# EAGLE design Power Distribution (EAGLE 6.2)
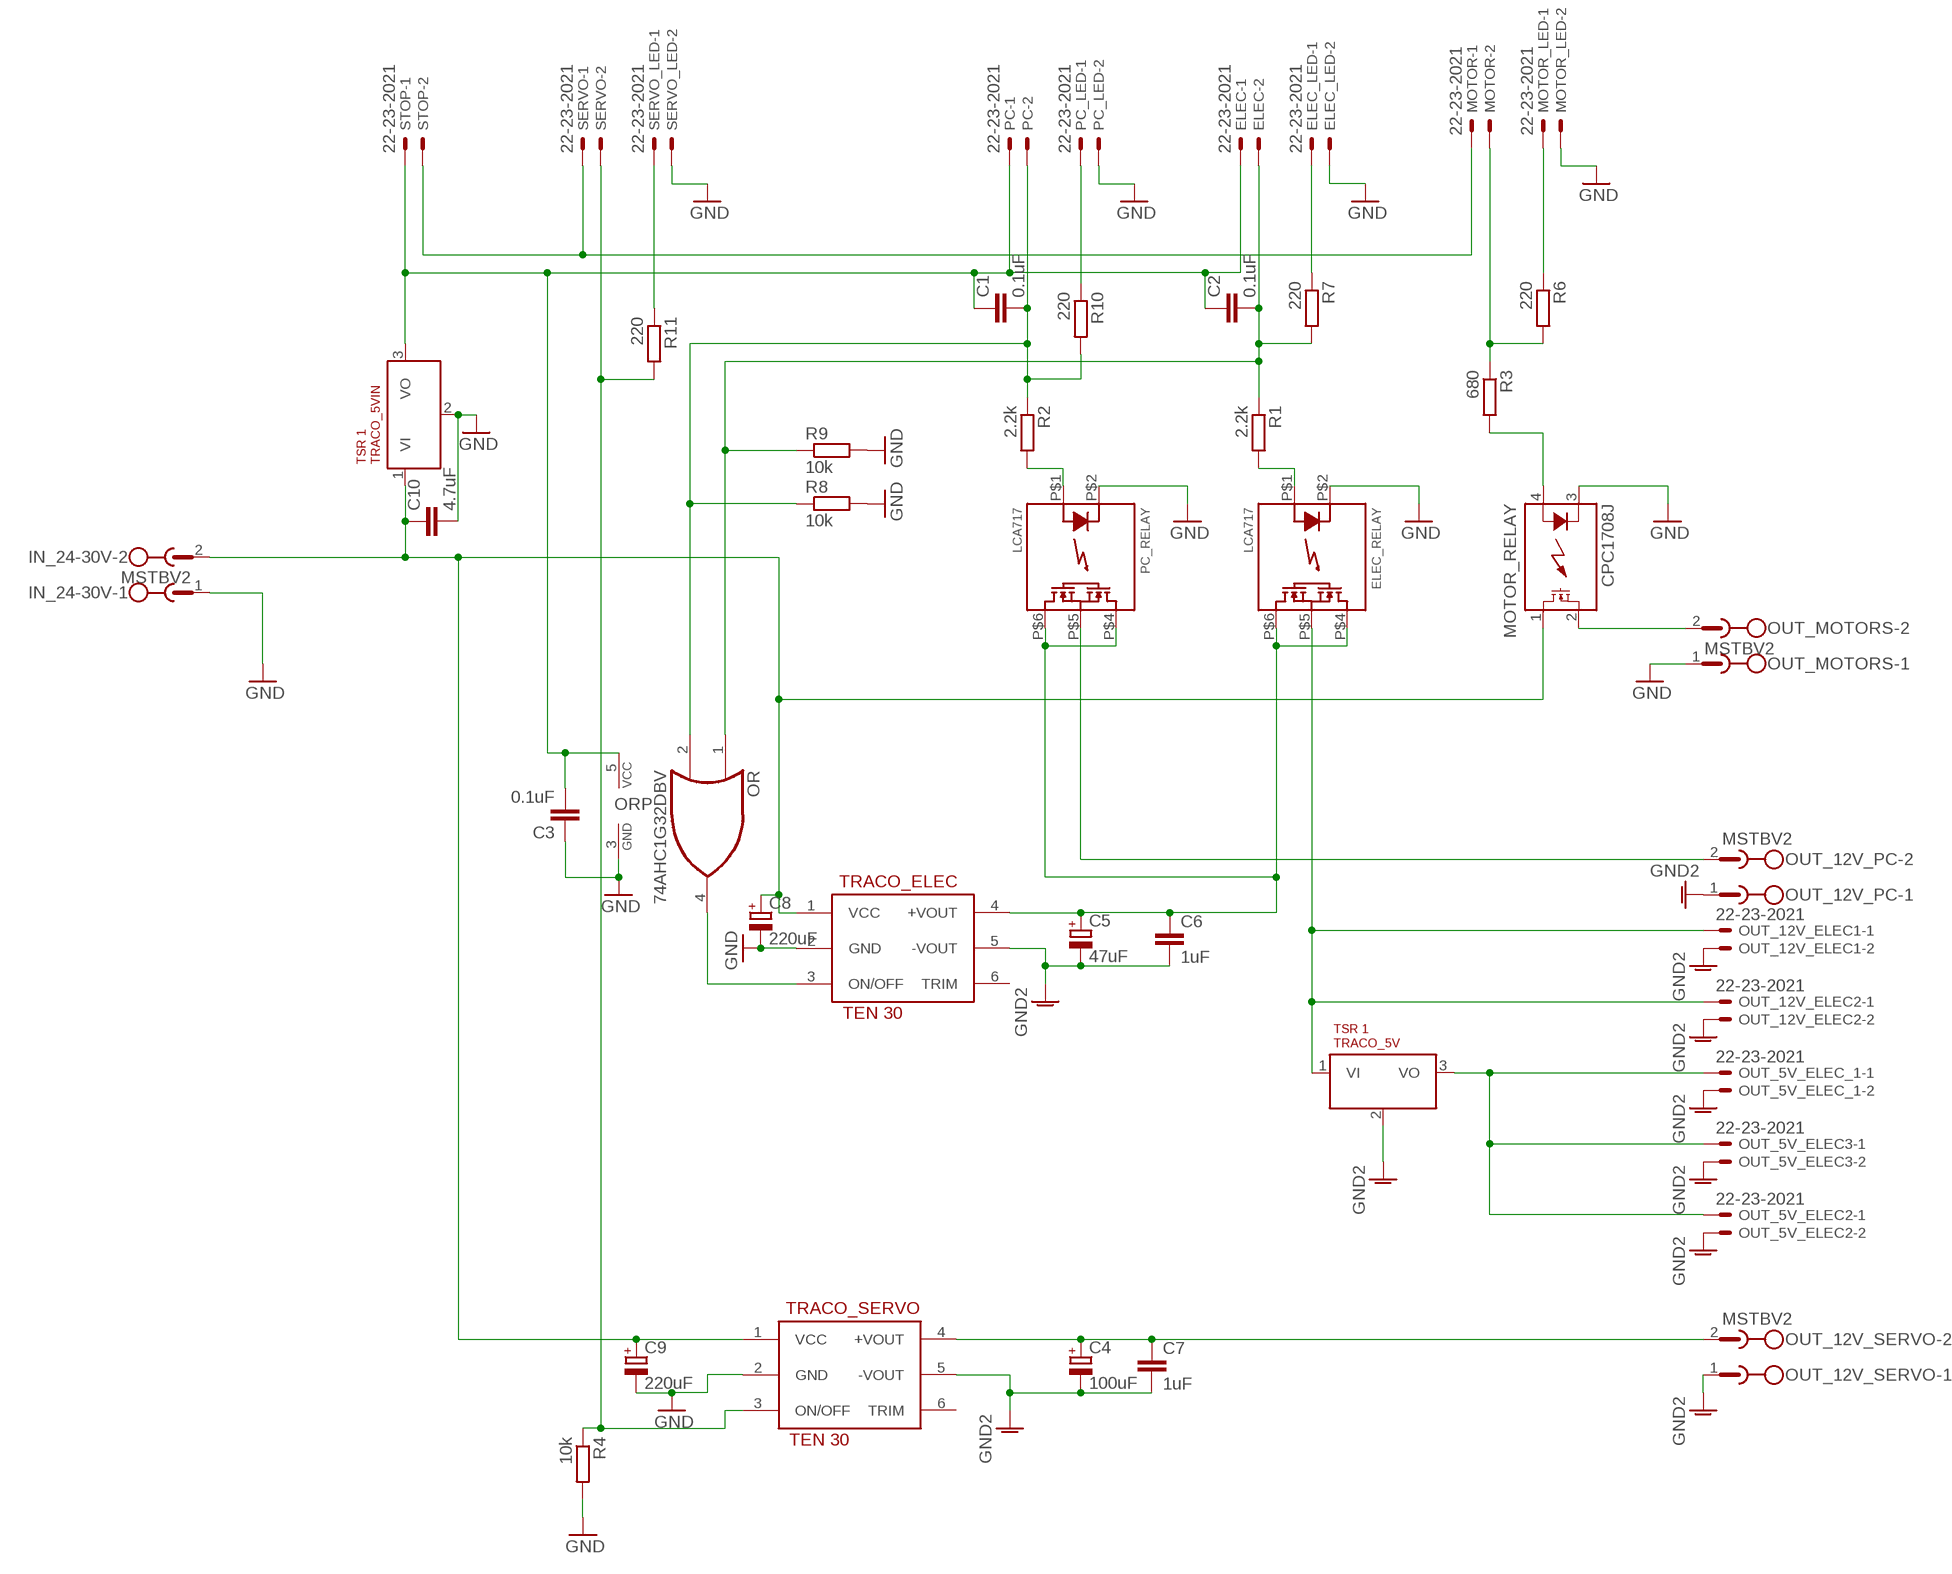
[diagram p0: schematic, sheet 1]

## Parts
C1  0.1uF  C-EUC0805  [C0805]
C2  0.1uF  C-EUC0805  [C0805]
C3  0.1uF  C-EUC0805  [C0805]
C4  100uF  CPOL-EUE2-5  [E2-5]
C5  47uF  CPOL-EUE2-5  [E2-5]
C6  1uF  C-EUC1206  [C1206]
C7  1uF  C-EUC1206  [C1206]
C8  220uF  CPOL-EUE3.5-8  [E3,5-8]
C9  220uF  CPOL-EUE3.5-8  [E3,5-8]
C10  4.7uF  C-EUC1210  [C1210]
ELEC  22-23-2021  [22-23-2021]
ELEC_LED  22-23-2021  [22-23-2021]
ELEC_RELAY  LCA717  [DIP-6]
IN_24-30V  MSTBV2  [MSTBV2]
MOTOR  22-23-2021  [22-23-2021]
MOTOR_LED  22-23-2021  [22-23-2021]
MOTOR_RELAY  CPC1708J  [I4-PAC]
OR  74AHC1G32DBV  [SOT23-5]
OUT_5V_ELEC2  22-23-2021  [22-23-2021]
OUT_5V_ELEC3  22-23-2021  [22-23-2021]
OUT_5V_ELEC_1  22-23-2021  [22-23-2021]
OUT_12V_ELEC1  22-23-2021  [22-23-2021]
OUT_12V_ELEC2  22-23-2021  [22-23-2021]
OUT_12V_PC  MSTBV2  [MSTBV2]
OUT_12V_SERVO  MSTBV2  [MSTBV2]
OUT_MOTORS  MSTBV2  [MSTBV2]
PC  22-23-2021  [22-23-2021]
PC_LED  22-23-2021  [22-23-2021]
PC_RELAY  LCA717  [DIP-6]
R1  2.2k  R-EU_R0805  [R0805]
R2  2.2k  R-EU_R0805  [R0805]
R3  680  R-EU_R0805  [R0805]
R4  10k  R-EU_R0805  [R0805]
R6  220  R-EU_R0805  [R0805]
R7  220  R-EU_R0805  [R0805]
R8  10k  R-EU_R0805  [R0805]
R9  10k  R-EU_R0805  [R0805]
R10  220  R-EU_R0805  [R0805]
R11  220  R-EU_R0805  [R0805]
SERVO  22-23-2021  [22-23-2021]
SERVO_LED  22-23-2021  [22-23-2021]
STOP  22-23-2021  [22-23-2021]
TRACO_5V  TSR-1  [TRACO-TO220]
TRACO_5VIN  TSR-1  [TRACO-TO220]
TRACO_ELEC  TEN-30  [TRACO2X1]
TRACO_SERVO  TEN-50  TEN-30  [TRACO2X1]

## Nets
5V: C1.1 C2.1 C3.2 ELEC.1 OR.5(VCC) PC.1 STOP.1 TRACO_5VIN.3(VO)
AGND: C4.- C5.- C6.2 C7.2 OUT_5V_ELEC2.2 OUT_5V_ELEC3.2 OUT_5V_ELEC_1.2 OUT_12V_ELEC1.2 OUT_12V_ELEC2.2 OUT_12V_PC.1 OUT_12V_SERVO.1 TRACO_5V.2(GND) TRACO_ELEC.5(-VOUT) TRACO_SERVO.5(-VOUT) ; supply symbol labelled GND2
GND: C3.1 C8.- C9.- C10.2 ELEC_LED.2 ELEC_RELAY.P$2 IN_24-30V.1 MOTOR_LED.2 MOTOR_RELAY.3(K) OR.3(GND) OUT_MOTORS.1 PC_LED.2 PC_RELAY.P$2 R4.2 R8.2 R9.2 SERVO_LED.2 TRACO_5VIN.2(GND) TRACO_ELEC.2(GND) TRACO_SERVO.2(GND)
N$1: C8.+ C9.+ C10.1 IN_24-30V.2 MOTOR_RELAY.1(DS1) TRACO_5VIN.1(VI) TRACO_ELEC.1(VCC) TRACO_SERVO.1(VCC)
N$2: C4.+ C7.1 OUT_12V_SERVO.2 TRACO_SERVO.4(+VOUT)
N$3: MOTOR_RELAY.2(DS2) OUT_MOTORS.2
N$5: MOTOR_LED.1 R6.1
N$6: ELEC_RELAY.P$5 OUT_12V_ELEC1.1 OUT_12V_ELEC2.1 TRACO_5V.1(VI)
N$7: OUT_5V_ELEC2.1 OUT_5V_ELEC3.1 OUT_5V_ELEC_1.1 TRACO_5V.3(VO)
N$8: OUT_12V_PC.2 PC_RELAY.P$5
N$9: C5.+ C6.1 ELEC_RELAY.P$4 ELEC_RELAY.P$6 PC_RELAY.P$4 PC_RELAY.P$6 TRACO_ELEC.4(+VOUT)
N$12: MOTOR_RELAY.4(A) R3.2
N$14: ELEC_RELAY.P$1 R1.2
N$15: R4.1 R11.2 SERVO.2 TRACO_SERVO.3(ON/OFF)
N$16: C1.2 OR.2(I1) PC.2 R2.1 R8.1 R10.2
N$17: C2.2 ELEC.2 OR.1(I0) R1.1 R7.2 R9.1
N$18: MOTOR.2 R3.1 R6.2
N$19: MOTOR.1 SERVO.1 STOP.2
N$20: PC_RELAY.P$1 R2.2
N$21: OR.4(O) TRACO_ELEC.3(ON/OFF)
N$22: PC_LED.1 R10.1
N$23: R11.1 SERVO_LED.1
N$24: ELEC_LED.1 R7.1
Unconnected: TRACO_ELEC.6(TRIM) TRACO_SERVO.6(TRIM)

## Library data of the parts
C1-C3 C6 C7 C10 = rcl:C-EU: CAPACITOR, European symbol
C4 C5 C8 C9 = rcl:CPOL-EU: POLARIZED CAPACITOR, European symbol
ELEC ELEC_LED MOTOR MOTOR_LED OUT_5V_ELEC2 OUT_5V_ELEC3 OUT_5V_ELEC_1 OUT_12V_ELEC1 OUT_12V_ELEC2 PC PC_LED SERVO SERVO_LED STOP = con-molex:22-23-2021: .100" (2.54mm) Center Header - 2 Pin; MF: MOLEX; MPN: 22-23-2021; OC_FARNELL: 1462926; OC_NEWARK: 25C3832
ELEC_RELAY PC_RELAY = custom:LCA717
IN_24-30V OUT_12V_PC OUT_12V_SERVO OUT_MOTORS = con-phoenix-508:MSTBV2: PHOENIX; MPN: MSTBV 2,5/2-GF-5.08; OC_FARNELL: 1792792; OC_NEWARK: 69R9845
MOTOR_RELAY = relay:CPC1708J: Single-Pole, Normally Open i4-PAC (TM) DC Power Relay Source: Data sheet <http://www.clare.com/home/pdfs.nsf/www/CPC1708.pdf/$file/CPC1708.pdf>
OR = 74xx-little-us:74*1G32: 2-input OR gate
R1-R4 R6-R11 = rcl:R-EU_: RESISTOR, European symbol
TRACO_5V TRACO_5VIN = custom:TSR-1
TRACO_ELEC TRACO_SERVO = custom:TEN-30

## Board
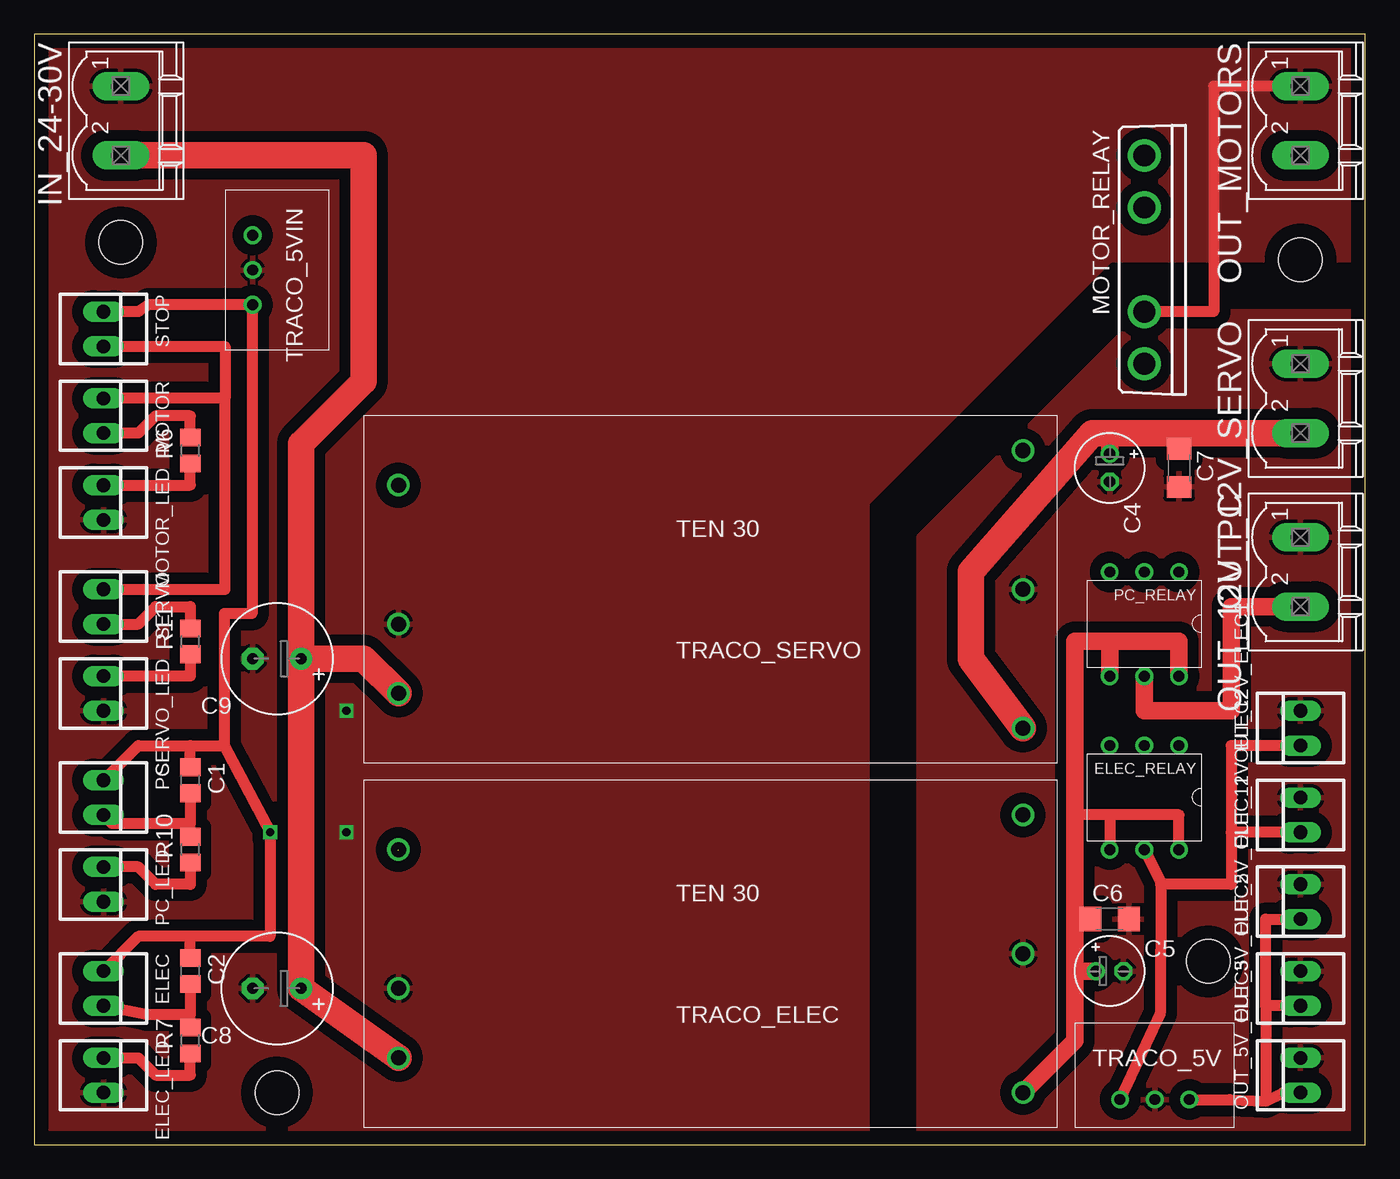
[diagram p1: board, top side]
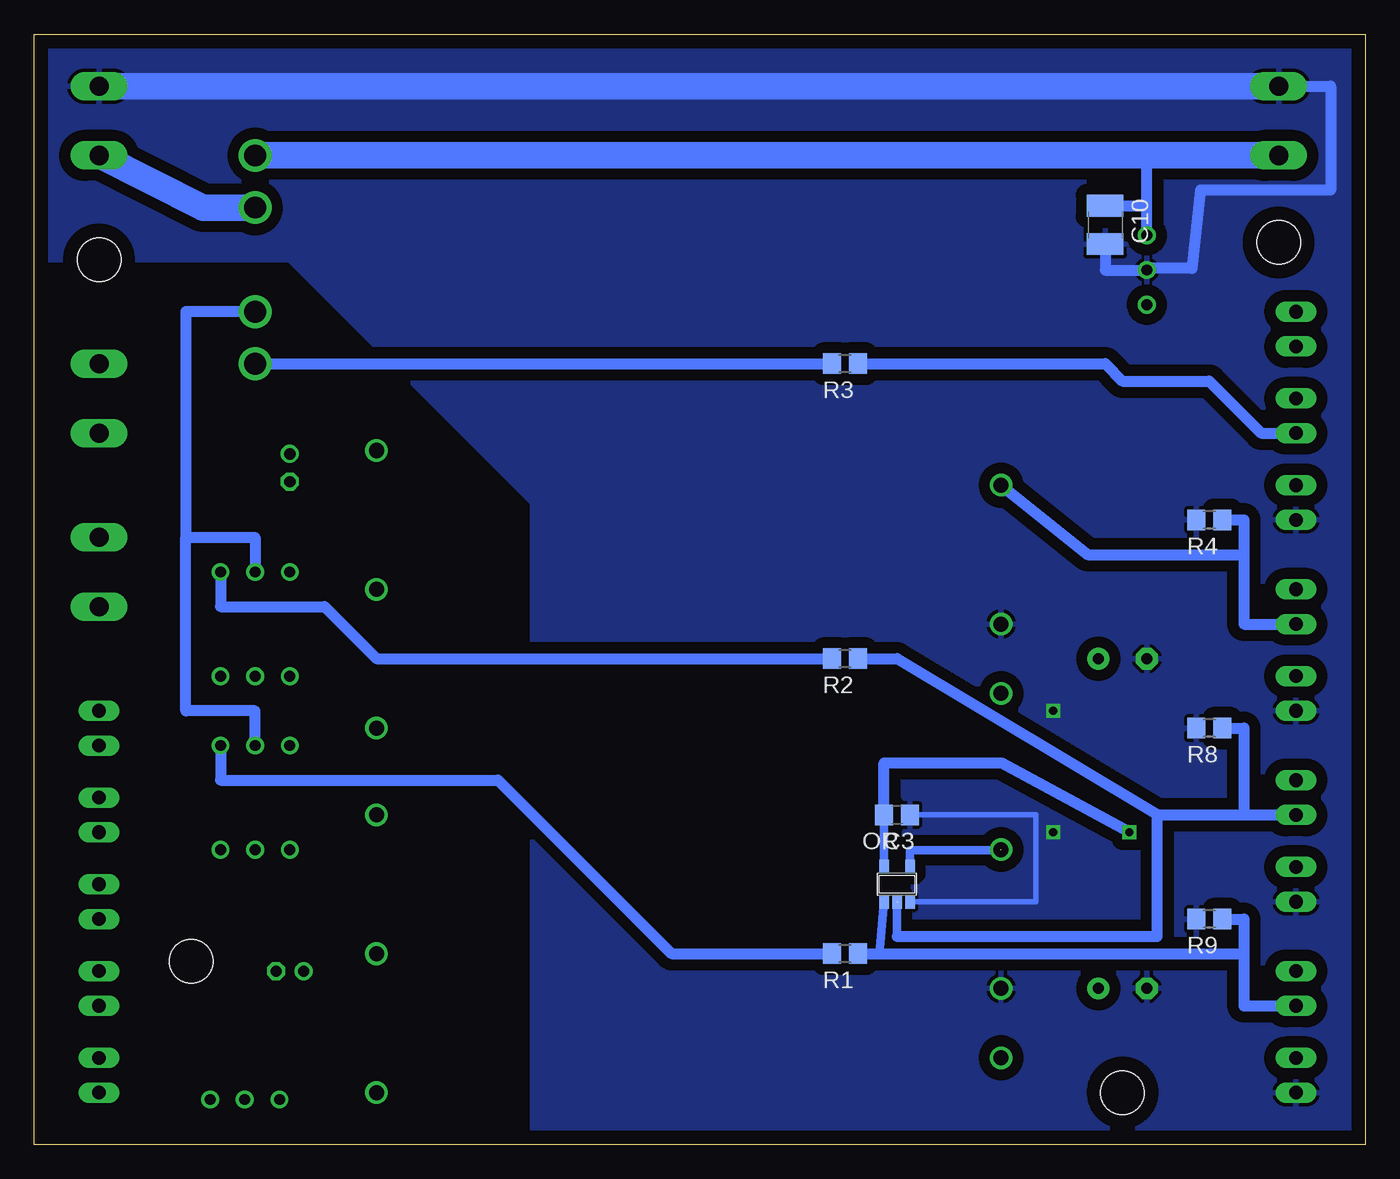
[diagram p2: board, bottom side, seen from below]

Size 97.46 x 81.27 mm. Coordinates in mm from the lower left corner, seen from the top.
Outline: 0,0 97.46,0 97.46,81.27 0,81.27 0,0
Copper layers (1*16): Top 0.035mm / dielectric 1.5mm / Bottom 0.035mm
Design rules: minimum track width 10mil, minimum drill 0.6mm, track to track 8mil, track to pad 8mil, pad to pad 8mil, via to via 8mil, smd to smd 8mil, copper to edge 40mil, drill to drill 8mil, minimum pad ring 10mil, minimum via ring 8mil, stop-mask expansion 4mil, vias tented up to drill 0mil, thermal gap 10mil
Holes 3.2 mm at 92.71,64.77 17.78,3.81 6.35,66.04 85.95,13.41

### Footprints (pad centres in the part's own frame; a part is rotated, then mirrored left to right if it is on the bottom)
C0805 = smd 1.3 x 1.5: 1 -0.95,0; 2 0.95,0
E2-5 = drill 0.813 pad 1.27: + -1.016,0 | drill 0.813 pad 1.27 octagon: - 1.016,0
C1206 = smd 1.6 x 1.8: 1 -1.4,0; 2 1.4,0
E3,5-8 = drill 0.813 pad 1.6: + -1.778,0 | drill 0.813 pad 1.6 octagon: - 1.778,0
C1210 = smd 1.6 x 2.7: 1 -1.4,0; 2 1.4,0
22-23-2021 = drill 1 long: 1 -1.27,0; 2 1.27,0
DIP-6 = drill 0.8: P$1 -2.54,-3.81; P$2 0,-3.81; P$3 2.54,-3.81; P$4 2.54,3.81; P$5 0,3.81; P$6 -2.54,3.81
MSTBV2 = drill 1.397 long: 1 -2.54,0; 2 2.54,0
I4-PAC = drill 1.6 pad 2.3: 1 -7.62,0; 2 -3.81,0; 3 3.81,0; 4 7.62,0
SOT23-5 = smd 0.69 x 0.99: 1 -0.95,-1.29; 2 0,-1.29; 3 0.95,-1.29; 4 0.95,1.3; 5 -0.95,1.3
R0805 = smd 1.3 x 1.5: 1 -0.95,0; 2 0.95,0
TRACO-TO220 = drill 0.8: 1 3.302,-5.588; 2 5.842,-5.588; 3 8.382,-5.588
TRACO2X1 = drill 1.1: 1 -22.86,-7.62; 2 -22.86,-2.54; 3 -22.86,7.62; 4 22.86,-10.16; 5 22.86,0; 6 22.86,10.16

### Placement (x,y rotation side)
C1  11.43,26.67 270 top
C2  11.43,12.7 270 top
C3  34.29,24.13 180 bottom
C4  78.74,49.53 270 top
C5  78.74,12.7 0 top
C6  78.74,16.51 0 top
C7  83.82,49.53 270 top
C8  17.78,11.43 180 top
C9  17.78,35.56 180 top
C10  19.05,67.31 270 bottom
ELEC  5.08,11.43 270 top
ELEC_LED  5.08,5.08 270 top
ELEC_RELAY  81.28,25.4 180 top
IN_24-30V  6.35,74.93 270 top
MOTOR  5.08,53.34 270 top
MOTOR_LED  5.08,46.99 270 top
MOTOR_RELAY  81.28,64.77 270 top
OR  34.29,19.05 0 bottom
OUT_5V_ELEC2  92.71,11.43 90 top
OUT_5V_ELEC3  92.71,5.08 90 top
OUT_5V_ELEC_1  92.71,17.78 90 top
OUT_12V_ELEC1  92.71,30.48 90 top
OUT_12V_ELEC2  92.71,24.13 90 top
OUT_12V_PC  92.71,41.91 270 top
OUT_12V_SERVO  92.71,54.61 270 top
OUT_MOTORS  92.71,74.93 270 top
PC  5.08,25.4 270 top
PC_LED  5.08,19.05 270 top
PC_RELAY  81.28,38.1 180 top
R1  38.1,13.97 180 bottom
R2  38.1,35.56 180 bottom
R3  38.1,57.15 180 bottom
R4  11.43,45.72 180 bottom
R6  11.43,50.8 90 top
R7  11.43,7.62 90 top
R8  11.43,30.48 180 bottom
R9  11.43,16.51 180 bottom
R10  11.43,21.59 90 top
R11  11.43,36.83 90 top
SERVO  5.08,39.37 270 top
SERVO_LED  5.08,33.02 270 top
STOP  5.08,59.69 270 top
TRACO_5V  76.2,8.89 0 top
TRACO_5VIN  21.59,69.85 270 top
TRACO_ELEC  49.53,13.97 0 top
TRACO_SERVO  49.53,40.64 0 top

### Tracks (layer width: path | path; a pad name or v marks a point on that pad's centre or on a via)
5V  (via drill 0.6)
  Top 0.813: 11.43,15.24 17.27,15.24 v17.27,22.86 13.92,29.21 | 11.43,15.24 7.62,15.24 ELEC.1 | STOP.1 7.62,60.96 8.38,61.47 TRACO_5VIN.3 15.95,61.47 15.95,38.86 13.92,38.86 13.92,29.21 | PC.1 7.62,29.21 11.43,29.21 | 11.43,29.21 13.92,29.21 | C2.1 11.43,15.24 | C1.1 11.43,29.21
  Bottom 0.61: OR.5 C3.2
  Bottom 0.813: C3.2 35.24,27.94 26.67,27.94 v17.27,22.86
AGND
  pour Top (isolate 0.813): 97.79,0 64.77,0 64.77,44.45 81.28,60.96 97.79,60.96
GND  (via drill 0.6)
  Top 0.813: OUT_MOTORS.1 86.36,77.47 86.36,60.96 MOTOR_RELAY.3
  Bottom 0.406: C3.1 24.13,24.13 24.13,17.78 33.34,17.78 OR.3
  Bottom 0.813: C10.2 19.05,64.01 TRACO_5VIN.2 15.88,64.14 12.7,64.14 12.06,69.85 2.54,69.85 2.54,77.47 IN_24-30V.1 | ELEC_RELAY.P$2 81.28,31.75 86.36,31.75 86.36,44.45 | 86.36,44.45 81.28,44.45 PC_RELAY.P$2 | MOTOR_RELAY.3 86.36,60.96 86.36,44.45
  Bottom 1.93: IN_24-30V.1 OUT_MOTORS.1
  other vias: 22.86,22.86 22.86,31.75
  pour Top (isolate 0.813): 0,0 60.96,0 60.96,46.99 78.74,64.77 97.79,64.77 97.79,81.28 0,81.28
  pour Bottom (isolate 0.813): 0,81.28 0,0 60.96,0 60.96,46.99 78.74,64.77 97.79,64.77 97.79,81.28
N$1
  Top 1.93: IN_24-30V.2 24.13,72.39 24.13,55.88 19.56,51.31 C9.+ | C9.+ C8.+ TRACO_ELEC.1 | C9.+ 24.13,35.56 TRACO_SERVO.1
  Bottom 0.813: TRACO_5VIN.1 16,68.71 | 16,68.71 16,71.88 16.51,72.39 | C10.1 16,68.71
  Bottom 1.93: IN_24-30V.2 16.51,72.39 MOTOR_RELAY.1
N$2
  Top 1.27: C7.1 83.82,52.07 | C4.+ 78.74,52.07
  Top 1.93: OUT_12V_SERVO.2 83.82,52.07 78.74,52.07 77.47,52.07 68.58,41.91 68.58,35.56 TRACO_SERVO.4
N$3
  Bottom 1.93: MOTOR_RELAY.2 85.09,68.58 OUT_MOTORS.2
N$5
  Top 0.813: MOTOR_LED.1 11.43,48.26 R6.1
N$6
  Top 0.813: ELEC_RELAY.P$5 82.55,19.05 | TRACO_5V.1 82.45,9.6 82.47,19.05 82.55,19.05 | OUT_12V_ELEC2.1 87.63,22.86 | 87.63,22.86 87.63,19.05 82.55,19.05 | OUT_12V_ELEC1.1 87.63,29.21 87.63,22.86
N$7
  Top 0.813: OUT_5V_ELEC3.1 91.44,3.81 90.17,3.17 | OUT_5V_ELEC2.1 90.17,10.16 | 90.17,10.16 90.17,3.17 | 90.17,10.16 90.17,16.51 OUT_5V_ELEC_1.1 | TRACO_5V.3 87.5,3.3 90.17,3.17
N$8
  Top 1.27: PC_RELAY.P$5 81.28,31.75 87.63,31.75 87.63,39.37 OUT_12V_PC.2
N$9
  Top 0.813: ELEC_RELAY.P$6 83.82,24.13 78.74,24.13 | 78.74,24.13 ELEC_RELAY.P$4 | 78.74,24.13 76.2,24.13
  Top 1.27: PC_RELAY.P$6 83.82,36.83 78.74,36.83 | 78.74,36.83 PC_RELAY.P$4 | TRACO_ELEC.4 76.2,7.62 76.2,12.7 | 76.2,12.7 76.2,16.51 | 76.2,16.51 76.2,24.13 76.2,36.83 78.74,36.83 | C5.+ 76.2,12.7 | C6.1 76.2,16.51
N$12
  Bottom 0.813: MOTOR_RELAY.4 R3.2
N$14
  Bottom 0.813: ELEC_RELAY.P$1 83.82,26.67 63.5,26.67 50.8,13.97 R1.2
N$15
  Top 0.813: SERVO.2 7.62,38.1 8.89,39.37 11.43,39.37 R11.2
  Bottom 0.813: R4.1 8.89,45.72 8.89,43.18 | 8.89,43.18 8.89,38.1 SERVO.2 | TRACO_SERVO.3 20.32,43.18 8.89,43.18
N$16
  Top 0.813: R10.2 11.43,23.5 | 11.43,23.5 5.71,23.5 PC.2 | C1.2 11.43,23.5
  Bottom 0.61: OR.2 34.29,15.24
  Bottom 0.813: R8.1 8.89,30.48 8.89,24.13 | 8.89,24.13 PC.2 | R2.1 34.29,35.56 15.24,24.13 | 15.24,24.13 8.89,24.13 | 34.29,15.24 15.24,15.24 15.24,24.13
N$17
  Top 0.813: ELEC.2 8.26,9.53 11.43,9.53 | R7.2 11.43,9.53 | C2.2 11.43,9.53
  Bottom 0.61: OR.1 35.56,13.97
  Bottom 0.813: R9.1 8.89,16.51 8.89,13.97 | 8.89,13.97 8.89,10.16 ELEC.2 | R1.1 35.56,13.97 8.89,13.97
N$18
  Top 0.813: R6.2 11.43,53.34 8.89,53.34 7.62,52.07 MOTOR.2
  Bottom 0.813: R3.1 19.05,57.15 17.78,55.88 11.43,55.88 7.62,52.07 MOTOR.2
N$19
  Top 0.813: STOP.2 13.97,58.42 13.97,54.61 | 13.97,54.61 MOTOR.1 | SERVO.1 13.97,40.64 13.97,54.61
N$20
  Bottom 0.813: PC_RELAY.P$1 83.82,39.37 76.2,39.37 72.39,35.56 R2.2
N$21  (1 unrouted)
  Bottom 0.61: 26.64,21.56 33.34,21.56 OR.4
N$22
  Top 0.813: R10.1 11.43,19.05 8.89,19.05 7.62,20.32 PC_LED.1
N$23
  Top 0.813: R11.1 11.43,34.29 SERVO_LED.1
N$24
  Top 0.813: ELEC_LED.1 7.62,6.35 8.89,5.08 11.43,5.08 R7.1